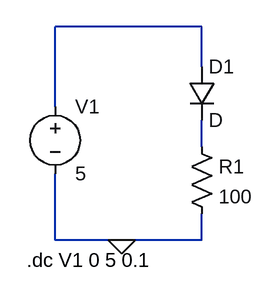
[diagram p0: schematic 1SourceDCSweep.asc]
1SourceDCSweep.asc, the LTspice schematic file:
Version 4
SHEET 1 880 680
WIRE 224 32 48 32
WIRE 224 80 224 32
WIRE 48 128 48 32
WIRE 224 176 224 144
WIRE 48 288 48 208
WIRE 128 288 48 288
WIRE 224 288 224 256
WIRE 224 288 128 288
FLAG 128 288 0
SYMBOL diode 208 80 R0
SYMATTR InstName D1
SYMBOL res 208 160 R0
SYMATTR InstName R1
SYMATTR Value 100
SYMBOL voltage 48 112 R0
WINDOW 123 0 0 Left 0
WINDOW 39 0 0 Left 0
SYMATTR InstName V1
SYMATTR Value 5
TEXT 14 312 Left 2 !.dc V1 0 5 0.1

The netlist it stands for:
* 1SourceDCSweep.asc
D1 N001 N002 D
R1 N002 0 100
V1 N001 0 5
.model D D
.lib standard.dio
.dc V1 0 5 0.1
.backanno
.end